# Altium schematic sheet SystemCTL.SchDoc: DARKYDEN_SYSTEMCTL
size Letter; ApprovedBy: APPROUVÉ PAR; Author: Harold Malbrouck; Organization: Cegep Limoilou; Address1: 1300, 8e Avenue; Address2: Québec, QC; Address3: Canada; Address4: G1J 5L5; Revision: Rev.A; SheetNumber: 2; SheetTotal: 23
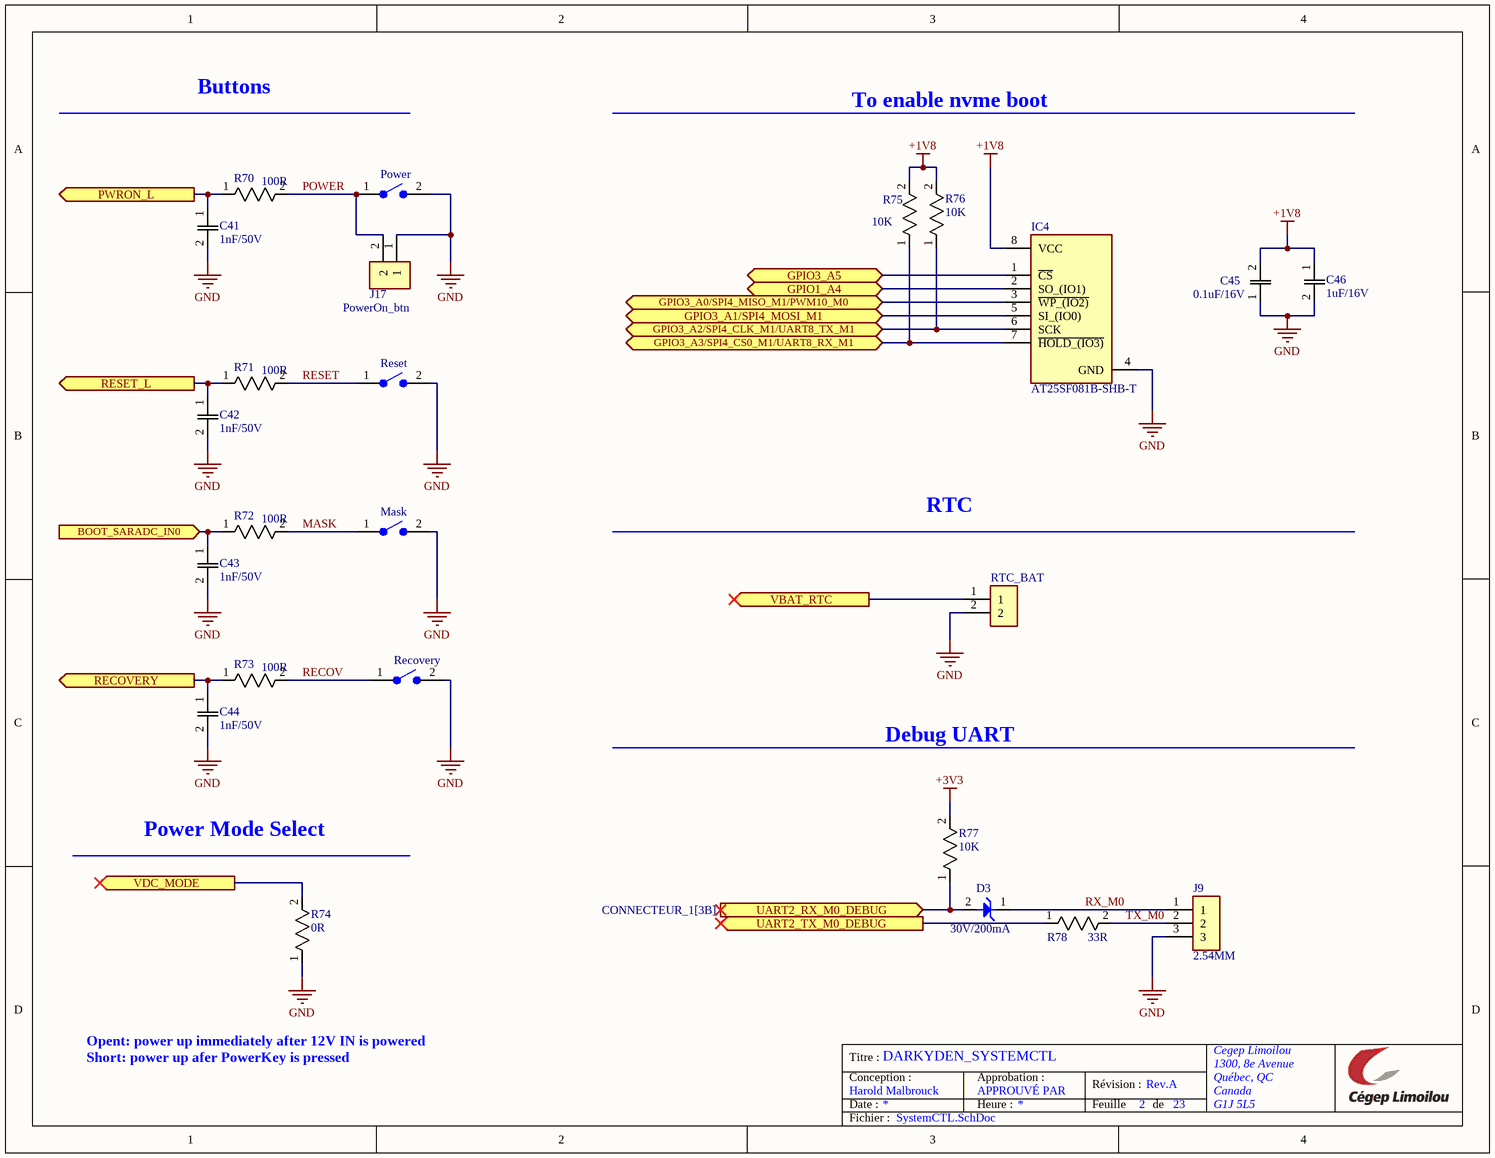
[diagram p0: SystemCTL.SchDoc]

## Parts
C41  1nF/50V  [C0805]
C42  1nF/50V  [C0805]
C43  1nF/50V  [C0805]
C44  1nF/50V  [C0805]
C45  0.1uF/16V  [C0805]
C46  1uF/16V  [C0805]
D3  30V/200mA  [SODFL1608X70N]
IC4  AT25SF081B-SHB-T  [SOIC127P798X216-8N]
J9  2.54MM  [HDRV3W64P0X254_1X3_762X254X864P]  (no BOM)
J17  PowerOn_btn  [HDRV2W110P0X254_1X2_508X254X854P]
Mask  SW_SMT  [SW_TS06-667-25-BK-100-G-SMT-TR]  (value not drawn)
Power  SW_SMT  [SW_TS06-667-25-BK-100-G-SMT-TR]  (value not drawn)
R70  100R  [RESC1608X55N]
R71  100R  [RESC1608X55N]
R72  100R  [RESC1608X55N]
R73  100R  [RESC1608X55N]
R74  0R  [RESC1608X55N]
R75  10K  [RESC1608X55N]
R76  10K  [RESC1608X55N]
R77  10K  [RESC1608X55N]
R78  33R  [RESC1608X55N]
Recovery  SW_SMT  [SW_TS06-667-25-BK-100-G-SMT-TR]  (value not drawn)
Reset  SW_SMT  [SW_TS06-667-25-BK-100-G-SMT-TR]  (value not drawn)
RTC_BAT  (no value)  [HDRV2W110P0X254_1X2_508X254X854P]

## Ports
BOOT_SARADC_IN0 (in, see CONNECTEUR_1[1B]), GPIO1_A4 (bidir, see CONNECTEUR_3[1C]), GPIO3_A0/SPI4_MISO_M1/PWM10_M0 (bidir, see CONNECTEUR_4[1C]), GPIO3_A1/SPI4_MOSI_M1 (bidir, see CONNECTEUR_4[2C]), GPIO3_A2/SPI4_CLK_M1/UART8_TX_M1 (bidir, see CONNECTEUR_4[1C]), GPIO3_A3/SPI4_CS0_M1/UART8_RX_M1 (bidir, see CONNECTEUR_4[1C]), GPIO3_A5 (bidir, see CONNECTEUR_4[2C]), PWRON_L (out, see CONNECTEUR_1[1B]), RECOVERY (out, see CONNECTEUR_2[1A]), RESET_L (out, see CONNECTEUR_1[3B]), UART2_RX_M0_DEBUG (in, see CONNECTEUR_1[3B]), UART2_TX_M0_DEBUG (out, see CONNECTEUR_1[3B]), VBAT_RTC (out, see CONNECTEUR_3[3C]), VDC_MODE (out, see CONNECTEUR_1[3B])

## Nets
+1V8: C45.2 C46.1 IC4.8(VCC) R75.2 R76.2
+3V3: R77.2
GND: C41.2 C42.2 C43.2 C44.2 C45.1 C46.2 IC4.4(GND) J9.3 J17.1 Mask.2 Power.2 R74.1 Recovery.2 Reset.2 RTC_BAT.2
BOOT_SARADC_IN0: C43.1 R72.1 ; port BOOT_SARADC_IN0
GPIO1_A4: IC4.2(SO_(IO1)) ; port GPIO1_A4
GPIO3_A0/SPI4_MISO_M1/PWM10_M0: IC4.3(~{WP_(IO2)}) ; port GPIO3_A0/SPI4_MISO_M1/PWM10_M0
GPIO3_A1/SPI4_MOSI_M1: IC4.5(SI_(IO0)) ; port GPIO3_A1/SPI4_MOSI_M1
GPIO3_A2/SPI4_CLK_M1/UART8_TX_M1: IC4.6(SCK) R76.1 ; port GPIO3_A2/SPI4_CLK_M1/UART8_TX_M1
GPIO3_A3/SPI4_CS0_M1/UART8_RX_M1: IC4.7(~{HOLD_(IO3)}) R75.1 ; port GPIO3_A3/SPI4_CS0_M1/UART8_RX_M1
GPIO3_A5: IC4.1(~{CS}) ; port GPIO3_A5
MASK: Mask.1 R72.2
POWER: J17.2 Power.1 R70.2
PWRON_L: C41.1 R70.1 ; port PWRON_L
RECOV: R73.2 Recovery.1
RECOVERY: C44.1 R73.1 ; port RECOVERY
RESET: R71.2 Reset.1
RESET_L: C42.1 R71.1 ; port RESET_L
RX_M0: D3.1(K) J9.1
TX_M0: J9.2 R78.2
UART2_RX_M0_DEBUG: D3.2(A) R77.1 ; port UART2_RX_M0_DEBUG
UART2_TX_M0_DEBUG: R78.1 ; port UART2_TX_M0_DEBUG
VBAT_RTC: RTC_BAT.1 ; port VBAT_RTC
VDC_MODE: R74.2 ; port VDC_MODE

Not connected (* = marked no-connect by the designer): Mask 3 4 5(SHIELD); Power 3 4 5(SHIELD); Recovery 3 4 5(SHIELD); Reset 3 4 5(SHIELD)

## Notes on the sheet
- Buttons
- To enable nvme boot
- RTC
- Debug UART
- Power Mode Select
- Opent: power up immediately after 12V IN is powered
  Short: power up afer PowerKey is pressed
- Titre :
- Conception :
- Date :
- Approbation :
- Heure :
- Révision :
- Feuille
- de
- Fichier :

## Library data of the parts
C41-C44 = C0805C102K5RACTU: Multilayer Ceramic Capacitor 1000 Pf 50 V ½ 10% X7R 0805 [2012 Metric]; Manufacturer_Name: KEMET; Manufacturer_Part_Number: C0805C102K5RAC-TU; Dielectric Material: 4241ConductorMaterial; Value: 1nF; Voltage Rating (DC): 50V; Temperature Coefficient: 30ppm/°C; Datasheet Link: https://componentsearchengine.com/Datasheets/2/C0805C102K5RAC-TU.pdf; Height: 0.88mm; Supplier: Digikey; Supplier Part Number: 399-C0805C102K5RACTUCT-ND; Manufacturer: KEMET; Manufacturer Part Number: C0805C102K5RACTU; RoHS: Yes; Category: Ceramic Capacitors; Stock: 137971; Pricing: 1=0.11, 10=0.06, 100=0.0358, 1000=0.0235 (USD); Mounting Technology: Surface Mount,PCB; Case/Package: 0805; Pins: 2; Case Code (Imperial): 0805; Case Code (Metric): 2012; Material: 4241ConductorMaterial; Min Operating Temperature: -55°C; Max Operating Temperature: 125°C; Tolerance: 10%; Packaging: Tape and Reel; Dielectric: X7R; Voltage: 50V; Series: SMD Comm X7R; Voltage Rating: 50V; Package Quantity: 4000; Termination: SMD/SMT; Construction: Flat; Length: 2mm; Width: 1.25mm; Lead Pitch: 0.75mm; Depth: 1.25mm; Thickness: 889um; Radiation Hardening: No; Reach SVHC Compliant: No; RoHS Compliant: Yes; Lead Free: 5697LeadFree; ComponentLink1URL: https://datasheet.ciiva.com/18193/getdatasheetpartid-385640-18193338.pdf?src-supplier=Verical; ComponentLink1Description: https://datasheet.ciiva.com/18193/getdatasheetpartid-385640-18193338.pdf?src-supplier=Verical; ComponentLink2URL: https://datasheet.ciiva.com/39122/docfinderpartnumberc0402c102k5ractu-39122922.pdf?src-supplier=Onlinecomponents.com; ComponentLink2Description: https://datasheet.ciiva.com/39122/docfinderpartnumberc0402c102k5ractu-39122922.pdf?src-supplier=Onlinecomponents.com; ComponentLink3URL: https://datasheet.ciiva.com/7842/1918693-7842527.pdf?src-supplier=Element14; ComponentLink3Description: https://datasheet.ciiva.com/7842/1918693-7842527.pdf?src-supplier=Element14
C45 = C0805C104K4RACAUTO: 0.1uF/16V ±10% X7R 0805 (2012METRIC) Ceramic Capacitor SMD Auto X7R; Mfr_Name: Kemet; Material: 4241ConductorMaterial; Value: 100nF; Temperature Coefficient: 30ppm/°C; Voltage Rating: 16V; Supplier: Digikey; Supplier Part Number: 399-C0805C104K4RACAUTOCT-ND; Manufacturer: KEMET; Manufacturer Part Number: C0805C104K4RACAUTO; RoHS: Yes; Category: Ceramic Capacitors; Stock: 27573; Pricing: 1=0.19, 10=0.108, 100=0.0672, 1000=0.04624 (USD); Case/Package: 0805; Dielectric Material: 4241ConductorMaterial; Min Operating Temperature: -55°C; Max Operating Temperature: 125°C; Tolerance: 10%; Packaging: Tape and Reel; Dielectric: X7R; Voltage Rating (DC): 16V; Length: 2mm; Depth: 1.25mm; RoHS Compliant: Yes
C46 = C0805C105K4RACTU: 1uF/16 V, X7R, Surface Mount, 0805; Manufacturer_Name: KEMET; Material: 4241ConductorMaterial; Value: 1uF; Tolerance: 10%; Voltage Rating (DC): 16V; Datasheet Link: https://content.kemet.com/datasheets/KEM_C1002_X7R_SMD.pdf; Height: 1.1mm; Manufacturer_Part_Number: C0805C105K4RACTU; Mouser Part Number: 80-C0805C105K4R; Mouser Price/Stock: https://www.mouser.co.uk/ProductDetail/KEMET/C0805C105K4RACTU?qs=yrVqjCObULOefkidH6lLLQ%3D%3D; Arrow Part Number: C0805C105K4RACTU; Arrow Price/Stock: https://www.arrow.com/en/products/c0805c105k4ractu/kemet-corporation?utm_currency=USD&region=nac; Supplier: Digikey; Supplier Part Number: 399-C0805C105K4RACTUCT-ND; Manufacturer: KEMET; Manufacturer Part Number: C0805C105K4RACTU; RoHS: Yes; Category: Ceramic Capacitors; Stock: 422443; Pricing: 1=0.12, 10=0.068, 100=0.041, 1000=0.04021, 2500=0.02182, 5000=0.02051, 7500=0.02038, 12500=0.01866, 17500=0.01858, 25000=0.01797, 62500=0.01676, 125000=0.01602, 250000=0.01544 (USD); Mounting Technology: Surface Mount,PCB; Case/Package: 0805; Pins: 2; Case Code (Metric): 2012; Case Code (Imperial): 0805; Min Operating Temperature: -55°C; Max Operating Temperature: 125°C; Packaging: Tape and Reel; Dielectric: X7R; Package Quantity: 1; Voltage Rating: 16V; Termination: SMD/SMT; Series: SMD Comm X7R; Construction: Flat; Voltage: 16V; Voltage Rating (AC): 16V; Length: 2mm; Width: 0.049inch; Thickness: 0.039inch; Depth: 1.25mm; Radiation Hardening: No; Reach SVHC Compliant: No; RoHS Compliant: Yes; Lead Free: 5697LeadFree; ComponentLink1URL: https://datasheet.ciiva.com/6074/1722731-6074364.pdf?src-supplier=Farnell; ComponentLink1Description: https://datasheet.ciiva.com/6074/1722731-6074364.pdf?src-supplier=Farnell; ComponentLink2URL: https://datasheet.ciiva.com/39122/docfinderpartnumberc0402c102k5ractu-39122926.pdf?src-supplier=Onlinecomponents.com; ComponentLink2Description: https://datasheet.ciiva.com/39122/docfinderpartnumberc0402c102k5ractu-39122926.pdf?src-supplier=Onlinecomponents.com; ComponentLink3URL: https://datasheet.ciiva.com/45846/docfinderpartnumberc0402c102k5ractu-45846934.pdf?src-supplier=Onlinecomponents.com; ComponentLink3Description: https://datasheet.ciiva.com/45846/docfinderpartnumberc0402c102k5ractu-45846934.pdf?src-supplier=Onlinecomponents.com; ComponentLink4URL: https://datasheet.ciiva.com/18193/getdatasheetpartid-331279-18193467.pdf?src-supplier=Verical; ComponentLink4Description: https://datasheet.ciiva.com/18193/getdatasheetpartid-331279-18193467.pdf?src-supplier=Verical; ComponentLink5URL: https://datasheet.ciiva.com/14585/70095383-14585511.pdf?src-supplier=Allied+Electronics; ComponentLink5Description: https://datasheet.ciiva.com/14585/70095383-14585511.pdf?src-supplier=Allied+Electronics; ComponentLink6URL: https://datasheet.ciiva.com/14603/70095383-14603388.pdf?src-supplier=Allied+Electronics; ComponentLink6Description: https://datasheet.ciiva.com/14603/70095383-14603388.pdf?src-supplier=Allied+Electronics; ComponentLink7URL: https://datasheet.ciiva.com/28692/1851736-28692942.pdf?src-supplier=Element14; ComponentLink7Description: https://datasheet.ciiva.com/28692/1851736-28692942.pdf?src-supplier=Element14
D3 = RB521S30T1G: SCHOTTKY BARRIER DIODE Rectifier Diode, Schottky, 1 Phase, 1 Element, 0.2A, 30V V(RRM), Silicon; Manufacturer_Name: onsemi; Manufacturer: ON Semiconductor; Forward Current: 200mA; Element Configuration: Single; Peak Non-Repetitive Surge Current: 1A; Max Reverse Current: 30uA; Forward Voltage: 500mV; Power Dissipation: 200mW; Polarity: Standard; Datasheet Link: https://www.onsemi.com/pub/Collateral/RB521S30T1-D.PDF; Height: 0.7mm; Manufacturer_Part_Number: RB521S30T1G; Mouser Part Number: 863-RB521S30T1G; Mouser Price/Stock: https://www.mouser.co.uk/ProductDetail/onsemi/RB521S30T1G?qs=xZq1yRCsb1eKFKS8TVH%2Fqg%3D%3D; Arrow Part Number: RB521S30T1G; Arrow Price/Stock: https://www.arrow.com/en/products/rb521s30t1g/on-semiconductor?region=europe; Supplier: Digikey; Supplier Part Number: RB521S30T1GOSCT-ND; Manufacturer Part Number: RB521S30T1G; RoHS: Yes; Category: Rectifier Diodes; Stock: 15002; Pricing: 1=0.1, 10=0.065, 100=0.0546, 500=0.0395, 1000=0.0309 (USD); Case/Package: SOD-523-2; Pins: 2; Min Operating Temperature: -55°C; Max Operating Temperature: 125°C; Package Quantity: 1; Packaging: Tape and Reel; Max Repetitive Reverse Voltage (Vrrm): 30V; Series: -; Average Rectified Current: 200mA; Max Forward Surge Current (Ifsm): 1A; Current Rating: 200mA; Max Reverse Voltage (DC): 30V; Max Surge Current: 1A; Max Reverse Leakage Current: 30uA; Voltage Rating (DC): 30V; Output Current: 200mA; Length: 1.3mm; Width: 0.9mm; Radiation Hardening: No; RoHS Compliant: Yes; Lead Free: Lead Free; Reach SVHC Compliant: No; ComponentLink1URL: https://datasheet.ciiva.com/915/rb521s30t1-d-915380.pdf?src-supplier=Digikey; ComponentLink1Description: https://datasheet.ciiva.com/915/rb521s30t1-d-915380.pdf?src-supplier=Digikey; ComponentLink2URL: https://datasheet.ciiva.com/30479/0900766b8127cb13-30479125.pdf?src-supplier=Rs; ComponentLink2Description: https://datasheet.ciiva.com/30479/0900766b8127cb13-30479125.pdf?src-supplier=Rs; ComponentLink3URL: https://datasheet.ciiva.com/34302/1188931-34302065.pdf?src-supplier=Jameco; ComponentLink3Description: https://datasheet.ciiva.com/34302/1188931-34302065.pdf?src-supplier=Jameco; ComponentLink4URL: https://datasheet.ciiva.com/1243/rb521s30t1-d-1243283.pdf?src-supplier=Newark; ComponentLink4Description: https://datasheet.ciiva.com/1243/rb521s30t1-d-1243283.pdf?src-supplier=Newark; ComponentLink5URL: https://datasheet.ciiva.com/915/rb521s30t1-d-915382.pdf?src-supplier=Digikey; ComponentLink5Description: https://datasheet.ciiva.com/915/rb521s30t1-d-915382.pdf?src-supplier=Digikey; ComponentLink6URL: https://datasheet.ciiva.com/16221/rb521s30t1-d-16221823.pdf?src-supplier=Future+Electronics; ComponentLink6Description: https://datasheet.ciiva.com/16221/rb521s30t1-d-16221823.pdf?src-supplier=Future+Electronics
IC4 = AT25SF081B-SHB-T: FLASH - NOR Memory IC 8Mb (1M x 8) SPI - Quad I/O 108 MHz 8-SOIC; Manufacturer_Name: Adesto Technologies; Manufacturer: Renesas; Package Body Material: Plastic; Data Retention Time-Min: 20; Endurance: 100000Cycles; Density: 8388608b; Memory Width: 8; Channels: 1; Operating Mode: SYNCHRONOUS; Output Characteristics: 3-STATE; Package Equivalence Code: SOP8,.3; Parallel/Serial: SERIAL; Programming Voltage: 3V; Serial Bus Type: QSPI; Standby Current-Max: 30uA; Max Supply Current: 16mA; Write Protection: HARDWARE/SOFTWARE; Clock Frequency: 108MHz; Min Supply Voltage: 2.7V; Max Supply Voltage: 3.6V; Datasheet Link: https://eu.mouser.com/datasheet/2/590/at25sf081b-1888118.pdf; Height: 2.16mm; Manufacturer_Part_Number: AT25SF081B-SHB-T; Mouser Part Number: 988-AT25SF081B-SHB-T; Mouser Price/Stock: https://www.mouser.co.uk/ProductDetail/Adesto-Technologies/AT25SF081B-SHB-T?qs=wnTfsH77Xs46OZOQzObQdg%3D%3D; Supplier: Digikey; Supplier Part Number: 1265-AT25SF081B-SHB-TCT-ND; Manufacturer Part Number: AT25SF081B-SHB-T; RoHS: Yes; Category: Memory; Stock: 39721; Pricing: 1=0.45, 10=0.42, 25=0.4088, 50=0.4004, 100=0.3918, 250=0.38028, 500=0.37154, 1000=0.3628 (USD); Pins: 8; Case/Package: SOP; Package Shape: Rectangular; Min Operating Temperature: -40°C; Max Operating Temperature: 85°C; Memory Format: FLASH; Type: NOR TYPE; JESD-30 Code: R-PDSO-G8; Moisture Sensitivity Level: 1; Number of Words Code: 1M; Surface Mount: Yes; Technology: CMOS; Terminal Form: Gull Wing; Terminal Position: DUAL; Nominal Supply Voltage: 3V; Length: 5.29mm; Width: 5.24mm; Height - Seated (Max): 2.16mm; Terminal Pitch: 1.27mm; RoHS Compliant: Yes; Reach SVHC Compliant: No; Temperature Grade: INDUSTRIAL
J9 = M20-9990345: Conn Unshrouded Header HDR 3 POS 2.54mm Solder ST Top Entry Thru-Hole Bag; Manufacturer_Name: Harwin; Current Rating: 3A; Contact Resistance: 25mR; Number of Positions: 3; Voltage Rating (AC): 750V; Insulation Resistance: 10GR; Datasheet Link: https://cdn.harwin.com/pdfs/M20-999.pdf; Height: 8.64mm; Manufacturer_Part_Number: M20-9990345; Mouser Part Number: 855-M20-9990345; Mouser Price/Stock: https://www.mouser.co.uk/ProductDetail/Harwin/M20-9990345?qs=ulE8k0yEMYbl6ZPCtNdmpA%3D%3D; Supplier: Digikey; Supplier Part Number: 952-2263-ND; Manufacturer: Harwin; Manufacturer Part Number: M20-9990345; RoHS: Yes; Category: Headers and Wire Housings; Stock: 53080; Pricing: 1=0.15, 10=0.124, 100=0.1053, 500=0.09398, 1000=0.08949, 5000=0.07987, 10000=0.07606 (USD); Mounting Technology: Through Hole; Case/Package: SIL; Contact Plating: Gold; Contact Material: Bronze,Brass; Color: Black; Weight: 0.006138oz; Housing Color: Black; Housing Material: Nylon; Min Operating Temperature: -40°C; Max Operating Temperature: 105°C; Package Quantity: 1000; Packaging: Bulk; Series: M20; Number of Rows: 1; Max Current Rating: 3A; Termination: Solder; Number of Contacts: 3; Orientation: Straight; Contact Type: Male Pin; Length: 7.62mm; Pitch: 2.54mm; Contact Mating Length: 0.24inch; Depth: 2.54mm; Radiation Hardening: No; RoHS Compliant: Yes; Reach SVHC Compliant: No; ComponentLink1URL: https://datasheet.ciiva.com/11747/0900766b80da602d-11747505.pdf?src-supplier=Rs; ComponentLink1Description: https://datasheet.ciiva.com/11747/0900766b80da602d-11747505.pdf?src-supplier=Rs; ComponentLink2URL: https://datasheet.ciiva.com/5160/m20-999-351179-5160492.pdf?src-supplier=Mouser; ComponentLink2Description: https://datasheet.ciiva.com/5160/m20-999-351179-5160492.pdf?src-supplier=Mouser; ComponentLink3URL: https://datasheet.ciiva.com/10151/m20-999-10151334.pdf?src-supplier=Avnet; ComponentLink3Description: https://datasheet.ciiva.com/10151/m20-999-10151334.pdf?src-supplier=Avnet
J17 RTC_BAT = 61300211121: THT Vertical Pin Header WR-PHD, Pitch 2.54 mm, Single Row, 2 pins; Manufacturer_Name: Wurth Elektronik; Manufacturer: Wurth Electronics; Current Rating: 3A; Voltage Rating: 250V; Number of Positions: 2; Gender: 29Gender; Contact Resistance: 20mR; Pitch: 0.1inch; Datasheet Link: https://componentsearchengine.com/Datasheets/2/61300211121.pdf; Height: 8.54mm; Manufacturer_Part_Number: 61300211121; Mouser Part Number: 710-61300211121; Mouser Price/Stock: https://www.mouser.co.uk/ProductDetail/Wurth-Elektronik/61300211121?qs=t4813l51qx%252B1A5GYDQxPlw%3D%3D; Supplier: Digikey; Supplier Part Number: 732-5315-ND; Manufacturer Part Number: 61300211121; RoHS: Yes; Category: Headers and Wire Housings; Stock: 95882; Pricing: 1=0.12, 10=0.102, 25=0.0848, 50=0.0712, 100=0.0639, 1000=0.06 (USD); Mounting Technology: Through Hole; Contact Plating: Gold; Housing Material: PBT; Contact Material: Copper Alloy,Copper; Color: Black; Min Operating Temperature: -40°C; Max Operating Temperature: 125°C; Number of Rows: 1; Contact Gender: Male; Packaging: Bulk; Termination: Through Hole; Number of Contacts: 2; Series: WR-PHD; Contact Type: Male Pin; Orientation: 5495OrientationType; Operating Supply Voltage: 250V; Contact Mating Length: 0.236inch; Lead Free: Lead Free; RoHS Compliant: Yes; Reach SVHC Compliant: Unknown; ComponentLink1URL: https://datasheet.ciiva.com/13619/6130xx11121-48870-13619345.pdf?src-supplier=Mouser; ComponentLink1Description: https://datasheet.ciiva.com/13619/6130xx11121-48870-13619345.pdf?src-supplier=Mouser
Mask Power Recovery Reset = SW_SMT: Switch Tactile OFF (ON) SPST Round Button Gull Wing 0.05A 12VDC 100000Cycles 1N SMD T/R; Manufacturer: Same Sky; MP: TS06-667-25-BK-100-G-SMT-TR; MF: {'manufacturer': u'CUI'}; Value: *; Package: None; Price: None; Availability: Unavailable; Supplier: Digikey; Supplier Part Number: 2223-TS06-667-25-BK-100-G-SMT-TRCT-ND; Manufacturer Part Number: TS06-667-25-BK-100-G-SMT-TR; RoHS: No; Stock: 1379; Pricing: 1=0.28, 10=0.246, 25=0.23, 100=0.2062, 250=0.19112, 500=0.18036 (USD)
R70-R73 = ERJ-3EKF1000V: 100 Ohm 1% 1/10W 0603 ±100ppm/°C Molded SMD Punched Carrier T/R; Manufacturer_Name: Panasonic; Power Rating: 100mW; Voltage Rating: 75V; Datasheet Link: http://industrial.panasonic.com/cdbs/www-data/pdf/RDA0000/AOA0000C86.pdf; Height: 0.55mm; Manufacturer_Part_Number: ERJ-3EKF1000V; Mouser Part Number: 667-ERJ-3EKF1000V; Mouser Price/Stock: https://www.mouser.co.uk/ProductDetail/Panasonic/ERJ-3EKF1000V?qs=H7k1u0Mp9JS7i8KGO5m47A%3D%3D; Arrow Part Number: ERJ-3EKF1000V; Arrow Price/Stock: https://www.arrow.com/en/products/erj-3ekf1000v/panasonic?utm_currency=USD&region=nac; Supplier: Digikey; Supplier Part Number: P100HCT-ND; Manufacturer: Panasonic; Manufacturer Part Number: ERJ-3EKF1000V; RoHS: Yes; Category: Chip SMD Resistors; Stock: 1036225; Pricing: 1=0.1, 10=0.035, 100=0.0177, 1000=0.01014, 2500=0.00888 (USD); Mounting Technology: Surface Mount; Case/Package: 0603; Contact Plating: Tin; Case Code (Imperial): 0603; Case Code (Metric): 1608; Weight: 7.1E-05oz; Min Operating Temperature: -55°C; Max Operating Temperature: 155°C; Packaging: Tape and Reel; Package Quantity: 5000; Termination: SMD/SMT; Series: ERJ; Value: 100R; Tolerance: 1%; Resistor Type: Thick Film; Number of Terminations: 2; Temperature Coefficient: 100ppm/°C; Max Power Dissipation: 100mW; Voltage Rating (DC): 75V; Features: Automotive AEC-Q200; Resistance Tolerance: 1%; Construction: Rectangular; Length: 1.6mm; Width: 0.8mm; Depth: 0.8mm; Radiation Hardening: No; Reach SVHC Compliant: No; Lead Free: Lead Free; RoHS Compliant: Yes; Military Standard: Not; ComponentLink1URL: https://datasheet.ciiva.com/34303/1987450-34303565.pdf?src-supplier=Jameco; ComponentLink1Description: https://datasheet.ciiva.com/34303/1987450-34303565.pdf?src-supplier=Jameco; ComponentLink2URL: https://datasheet.ciiva.com/9186/aoa0000ce2-9186725.pdf?src-supplier=Avnet; ComponentLink2Description: https://datasheet.ciiva.com/9186/aoa0000ce2-9186725.pdf?src-supplier=Avnet; ComponentLink3URL: https://datasheet.ciiva.com/48530/aoa0000ce2-48530986.pdf?src-supplier=Avnet; ComponentLink3Description: https://datasheet.ciiva.com/48530/aoa0000ce2-48530986.pdf?src-supplier=Avnet; ComponentLink4URL: https://datasheet.ciiva.com/7830/aoa0000ce2-7830728.pdf?src-supplier=Element14; ComponentLink4Description: https://datasheet.ciiva.com/7830/aoa0000ce2-7830728.pdf?src-supplier=Element14; ComponentLink5URL: https://datasheet.ciiva.com/22667/1678782-22667887.pdf?src-supplier=Element14; ComponentLink5Description: https://datasheet.ciiva.com/22667/1678782-22667887.pdf?src-supplier=Element14; ComponentLink6URL: https://datasheet.ciiva.com/46372/1678782-46372726.pdf?src-supplier=Element14; ComponentLink6Description: https://datasheet.ciiva.com/46372/1678782-46372726.pdf?src-supplier=Element14; ComponentLink7URL: https://datasheet.ciiva.com/46372/1678782-46372727.pdf?src-supplier=Element14; ComponentLink7Description: https://datasheet.ciiva.com/46372/1678782-46372727.pdf?src-supplier=Element14; ComponentLink8URL: https://datasheet.ciiva.com/24159/aoa0000ce2-24159753.pdf?src-supplier=Mouser; ComponentLink8Description: https://datasheet.ciiva.com/24159/aoa0000ce2-24159753.pdf?src-supplier=Mouser; ComponentLink9URL: https://datasheet.ciiva.com/16765/70260748-16765766.pdf?src-supplier=Allied+Electronics; ComponentLink9Description: https://datasheet.ciiva.com/16765/70260748-16765766.pdf?src-supplier=Allied+Electronics; ComponentLink10URL: https://datasheet.ciiva.com/16762/70260748-16762666.pdf?src-supplier=Allied+Electronics; ComponentLink10Description: https://datasheet.ciiva.com/16762/70260748-16762666.pdf?src-supplier=Allied+Electronics; ComponentLink11URL: https://datasheet.ciiva.com/30088/aoa0000ce2-30088649.pdf?src-supplier=Onlinecomponents.com; ComponentLink11Description: https://datasheet.ciiva.com/30088/aoa0000ce2-30088649.pdf?src-supplier=Onlinecomponents.com
R74 = ERJ-3GEY0R00V: Zero Ohm Resistor, Jumper, 0603 [1608 Metric], Thick Film, 100 mW, 1 A, Surface Mount; Manufacturer_Name: Panasonic; Power Rating: 100mW; Voltage Rating: 75V; Tolerance: 0%; Temperature Coefficient: 200ppm/°C; Datasheet Link: http://docs-europe.electrocomponents.com/webdocs/13ba/0900766b813ba21b.pdf; Height: 0.55mm; Manufacturer_Part_Number: ERJ-3GEY0R00V; Mouser Part Number: 667-ERJ-3GEY0R00V; Mouser Price/Stock: https://www.mouser.co.uk/ProductDetail/Panasonic/ERJ-3GEY0R00V?qs=66DK8nO8gJALIOqOWgiVwg%3D%3D; Arrow Part Number: ERJ-3GEY0R00V; Arrow Price/Stock: https://www.arrow.com/en/products/erj3gey0r00v/panasonic?region=europe; Supplier: Digikey; Supplier Part Number: P0.0GCT-ND; Manufacturer: Panasonic; Manufacturer Part Number: ERJ-3GEY0R00V; RoHS: Yes; Category: Chip SMD Resistors; Stock: 766631; Pricing: 1=0.1, 10=0.02, 25=0.0164, 50=0.0144, 100=0.0126, 250=0.0106, 500=0.00936, 1000=0.0083 (USD); Mounting Technology: Surface Mount; Case/Package: 0603; Case Code (Metric): 1608; Case Code (Imperial): 0603; Contact Plating: Tin; Min Operating Temperature: -55°C; Max Operating Temperature: 155°C; Packaging: Tape and Reel; Package Quantity: 5000; Value: 0R; Resistor Type: Thick Film; Number of Terminations: 2; Termination: SMD/SMT; Max Power Dissipation: 100mW; Features: Automotive AEC-Q200; Series: ERJ; Construction: Rectangular; Technology: THICK FILM; Length: 1.6mm; Width: 0.8mm; Depth: 0.8mm; Ratings: AEC-Q200; Radiation Hardening: No; Reach SVHC Compliant: No; Military Standard: Not; RoHS Compliant: Yes; Lead Free: 5697LeadFree; ComponentLink1URL: https://datasheet.ciiva.com/11808/0900766b80f806dd-11808207.pdf?src-supplier=Rs; ComponentLink1Description: https://datasheet.ciiva.com/11808/0900766b80f806dd-11808207.pdf?src-supplier=Rs; ComponentLink2URL: https://datasheet.ciiva.com/27055/1935748-27055113.pdf?src-supplier=Jameco; ComponentLink2Description: https://datasheet.ciiva.com/27055/1935748-27055113.pdf?src-supplier=Jameco; ComponentLink3URL: https://datasheet.ciiva.com/5959/1678796-5959707.pdf?src-supplier=Farnell; ComponentLink3Description: https://datasheet.ciiva.com/5959/1678796-5959707.pdf?src-supplier=Farnell; ComponentLink4URL: https://datasheet.ciiva.com/43460/1678796-43460647.pdf?src-supplier=Farnell; ComponentLink4Description: https://datasheet.ciiva.com/43460/1678796-43460647.pdf?src-supplier=Farnell; ComponentLink5URL: https://datasheet.ciiva.com/48532/aoa0000ce1-48532165.pdf?src-supplier=Avnet; ComponentLink5Description: https://datasheet.ciiva.com/48532/aoa0000ce1-48532165.pdf?src-supplier=Avnet; ComponentLink6URL: https://datasheet.ciiva.com/28695/1678796-28695833.pdf?src-supplier=Element14; ComponentLink6Description: https://datasheet.ciiva.com/28695/1678796-28695833.pdf?src-supplier=Element14; ComponentLink7URL: https://datasheet.ciiva.com/16834/aoa0000ce1-16834828.pdf?src-supplier=Future+Electronics; ComponentLink7Description: https://datasheet.ciiva.com/16834/aoa0000ce1-16834828.pdf?src-supplier=Future+Electronics; ComponentLink8URL: https://datasheet.ciiva.com/16758/70255313-16758527.pdf?src-supplier=Allied+Electronics; ComponentLink8Description: https://datasheet.ciiva.com/16758/70255313-16758527.pdf?src-supplier=Allied+Electronics; ComponentLink9URL: https://datasheet.ciiva.com/30199/4aoa0000ce1-30199822.pdf?src-supplier=Onlinecomponents.com; ComponentLink9Description: https://datasheet.ciiva.com/30199/4aoa0000ce1-30199822.pdf?src-supplier=Onlinecomponents.com; ComponentLink10URL: https://datasheet.ciiva.com/46377/1678796-46377868.pdf?src-supplier=Element14; ComponentLink10Description: https://datasheet.ciiva.com/46377/1678796-46377868.pdf?src-supplier=Element14; ComponentLink11URL: https://datasheet.ciiva.com/9198/aoa0000ce1-9198975.pdf?src-supplier=Avnet; ComponentLink11Description: https://datasheet.ciiva.com/9198/aoa0000ce1-9198975.pdf?src-supplier=Avnet
R75-R77 = ERJ-3GEYJ103V: 10K Ohm 5% Res Thick Film 0603  0.1W(1/10W) ±200ppm/C Pad SMD Automotive T/R; Manufacturer_Name: Panasonic; Value: 10kR; Temperature Coefficient: 200ppm/°C; Power Rating: 100mW; Voltage Rating: 75V; Datasheet Link: http://docs-europe.electrocomponents.com/webdocs/13ba/0900766b813ba21b.pdf; Height: 0.55mm; Manufacturer_Part_Number: ERJ-3GEYJ103V; Mouser Part Number: 667-ERJ-3GEYJ103V; Mouser Price/Stock: https://www.mouser.co.uk/ProductDetail/Panasonic/ERJ-3GEYJ103V?qs=66DK8nO8gJBWgc%252B0VNNxzg%3D%3D; Arrow Part Number: ERJ-3GEYJ103V; Arrow Price/Stock: https://www.arrow.com/en/products/erj-3geyj103v/panasonic?region=europe; Supplier: Digikey; Supplier Part Number: P10KGCT-ND; Manufacturer: Panasonic; Manufacturer Part Number: ERJ-3GEYJ103V; RoHS: Yes; Category: Chip SMD Resistors; Stock: 2191587; Pricing: 1=0.1, 10=0.033, 50=0.02, 100=0.0165, 500=0.01096, 1000=0.00939 (USD); Mounting Technology: Surface Mount; Case/Package: 0603; Case Code (Imperial): 0603; Case Code (Metric): 1608; Weight: 7.1E-05oz; Contact Plating: Tin; Min Operating Temperature: -55°C; Max Operating Temperature: 155°C; Tolerance: 5%; Packaging: Tape and Reel; Technology: THICK FILM; Package Quantity: 1; Resistor Type: Thick Film; Termination: SMD/SMT; Number of Terminations: 2; Max Power Dissipation: 100mW; Working Voltage: 75V; Features: Automotive AEC-Q200; Series: ERJ; Construction: Rectangular; Resistance Tolerance: 5%; Length: 1.6mm; Width: 0.8mm; Depth: 0.8mm; Reach SVHC Compliant: No; Military Standard: Not; Lead Free: Lead Free; RoHS Compliant: Yes; ComponentLink1URL: https://datasheet.ciiva.com/11809/0900766b80f806dd-11809566.pdf?src-supplier=Rs; ComponentLink1Description: https://datasheet.ciiva.com/11809/0900766b80f806dd-11809566.pdf?src-supplier=Rs; ComponentLink2URL: https://datasheet.ciiva.com/34303/2007265-34303757.pdf?src-supplier=Jameco; ComponentLink2Description: https://datasheet.ciiva.com/34303/2007265-34303757.pdf?src-supplier=Jameco; ComponentLink3URL: https://datasheet.ciiva.com/48531/aoa0000ce1-48531887.pdf?src-supplier=Avnet; ComponentLink3Description: https://datasheet.ciiva.com/48531/aoa0000ce1-48531887.pdf?src-supplier=Avnet; ComponentLink4URL: https://datasheet.ciiva.com/9117/aoa0000ce1-9117038.pdf?src-supplier=Avnet; ComponentLink4Description: https://datasheet.ciiva.com/9117/aoa0000ce1-9117038.pdf?src-supplier=Avnet; ComponentLink5URL: https://datasheet.ciiva.com/28514/1678796-28514213.pdf?src-supplier=Element14; ComponentLink5Description: https://datasheet.ciiva.com/28514/1678796-28514213.pdf?src-supplier=Element14; ComponentLink6URL: https://datasheet.ciiva.com/46371/1678796-46371909.pdf?src-supplier=Element14; ComponentLink6Description: https://datasheet.ciiva.com/46371/1678796-46371909.pdf?src-supplier=Element14; ComponentLink7URL: https://datasheet.ciiva.com/46385/1678796-46385240.pdf?src-supplier=Element14; ComponentLink7Description: https://datasheet.ciiva.com/46385/1678796-46385240.pdf?src-supplier=Element14; ComponentLink8URL: https://datasheet.ciiva.com/24133/aoa0000ce1-37422-24133064.pdf?src-supplier=Mouser; ComponentLink8Description: https://datasheet.ciiva.com/24133/aoa0000ce1-37422-24133064.pdf?src-supplier=Mouser; ComponentLink9URL: https://datasheet.ciiva.com/16740/aoa0000ce1-16740655.pdf?src-supplier=Future+Electronics; ComponentLink9Description: https://datasheet.ciiva.com/16740/aoa0000ce1-16740655.pdf?src-supplier=Future+Electronics; ComponentLink10URL: https://datasheet.ciiva.com/30147/4aoa0000ce1-30147029.pdf?src-supplier=Onlinecomponents.com; ComponentLink10Description: https://datasheet.ciiva.com/30147/4aoa0000ce1-30147029.pdf?src-supplier=Onlinecomponents.com
R78 = ERJ-3EKF33R0V: 33 Ohm 1% 0.1W 0603 ±100ppm/°C Molded SMD Punched Carrier T/R; Mfr_Name: Panasonic; Power Rating: 100mW; Voltage Rating: 75V; Supplier: Digikey; Supplier Part Number: P33.0HCT-ND; Manufacturer: Panasonic; Manufacturer Part Number: ERJ-3EKF33R0V; RoHS: Yes; Category: Chip SMD Resistors; Stock: 430721; Pricing: 1=0.1, 10=0.035, 100=0.0177, 1000=0.01014, 2500=0.00888 (USD); Mounting Technology: Surface Mount; Case/Package: 0603; Pins: 2; Case Code (Metric): 1608; Case Code (Imperial): 0603; Contact Plating: Tin; Min Operating Temperature: -55°C; Max Operating Temperature: 155°C; Value: 33R; Tolerance: 1%; Packaging: Tape and Reel; Package Quantity: 1; Resistor Type: Thick Film; Number of Terminations: 2; Temperature Coefficient: 100ppm/°C; Termination: SMD/SMT; Max Power Dissipation: 100mW; Voltage Rating (DC): 75V; Features: Automotive AEC-Q200; Series: ERJ; Construction: Rectangular; Resistance Tolerance: 1%; Length: 1.6mm; Width: 0.8mm; Height: 0.022inch; Depth: 0.8mm; Radiation Hardening: No; Reach SVHC Compliant: No; Military Standard: Not; Lead Free: Lead Free; RoHS Compliant: Yes; ComponentLink1URL: https://datasheet.ciiva.com/5917/aoa0000ce2-5917831.pdf?src-supplier=Farnell; ComponentLink1Description: https://datasheet.ciiva.com/5917/aoa0000ce2-5917831.pdf?src-supplier=Farnell; ComponentLink2URL: https://datasheet.ciiva.com/48531/aoa0000ce2-48531007.pdf?src-supplier=Avnet; ComponentLink2Description: https://datasheet.ciiva.com/48531/aoa0000ce2-48531007.pdf?src-supplier=Avnet; ComponentLink3URL: https://datasheet.ciiva.com/30250/aoa0000ce2-30250862.pdf?src-supplier=Onlinecomponents.com; ComponentLink3Description: https://datasheet.ciiva.com/30250/aoa0000ce2-30250862.pdf?src-supplier=Onlinecomponents.com; ComponentLink4URL: https://datasheet.ciiva.com/16778/70260748-16778478.pdf?src-supplier=Allied+Electronics; ComponentLink4Description: https://datasheet.ciiva.com/16778/70260748-16778478.pdf?src-supplier=Allied+Electronics; ComponentLink5URL: https://datasheet.ciiva.com/16781/70260748-16781237.pdf?src-supplier=Allied+Electronics; ComponentLink5Description: https://datasheet.ciiva.com/16781/70260748-16781237.pdf?src-supplier=Allied+Electronics; ComponentLink6URL: https://datasheet.ciiva.com/22673/1678782-22673288.pdf?src-supplier=Element14; ComponentLink6Description: https://datasheet.ciiva.com/22673/1678782-22673288.pdf?src-supplier=Element14; ComponentLink7URL: https://datasheet.ciiva.com/24026/aoa0000ce2-24026635.pdf?src-supplier=Mouser; ComponentLink7Description: https://datasheet.ciiva.com/24026/aoa0000ce2-24026635.pdf?src-supplier=Mouser; ComponentLink8URL: https://datasheet.ciiva.com/22687/1678782-22687390.pdf?src-supplier=Element14; ComponentLink8Description: https://datasheet.ciiva.com/22687/1678782-22687390.pdf?src-supplier=Element14; ComponentLink9URL: https://datasheet.ciiva.com/7836/aoa0000ce2-7836503.pdf?src-supplier=Element14; ComponentLink9Description: https://datasheet.ciiva.com/7836/aoa0000ce2-7836503.pdf?src-supplier=Element14; ComponentLink10URL: https://datasheet.ciiva.com/7836/426256-7836821.pdf?src-supplier=Element14; ComponentLink10Description: https://datasheet.ciiva.com/7836/426256-7836821.pdf?src-supplier=Element14